# EAGLE schematic IambicKey (EAGLE 6.5.0)
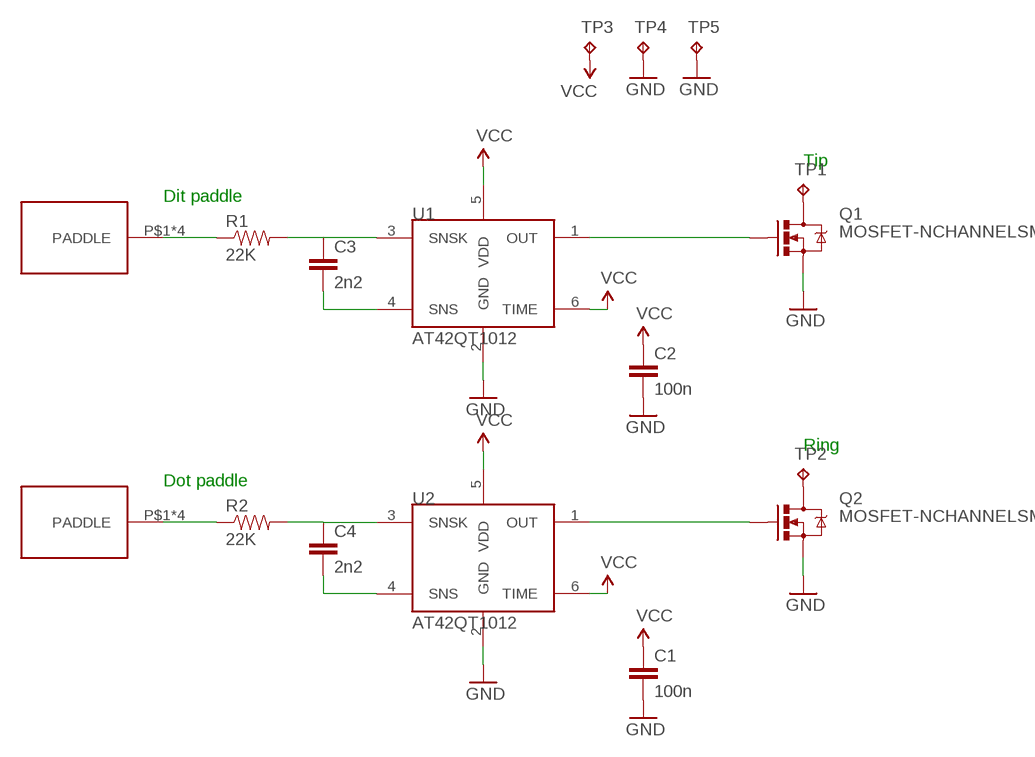
[diagram p0: schematic, sheet 1]

## Parts
C1  100n  CAP0603-CAP  [0603-CAP]
C2  100n  CAP0603-CAP  [0603-CAP]
C3  2n2  CAP0603-CAP  [0603-CAP]
C4  2n2  CAP0603-CAP  [0603-CAP]
Q1  MOSFET-NCHANNELSMD  [SOT23-3]
Q2  MOSFET-NCHANNELSMD  [SOT23-3]
R1  22K  RESISTOR0603-RES  [0603-RES]
R2  22K  RESISTOR0603-RES  [0603-RES]
TP1  TPTP20SQ  [TP20SQ]
TP2  TPTP20SQ  [TP20SQ]
TP3  TPTP20SQ  [TP20SQ]
TP4  TPTP20SQ  [TP20SQ]
TP5  TPTP20SQ  [TP20SQ]
U1  AT42QT1012  [SOT-23-6]
U2  AT42QT1012  [SOT-23-6]
U$1  PADDLE  [PADDLE]
U$2  PADDLE  [PADDLE]

## Nets
GND: C1.2 C2.2 Q1.2(S) Q2.2(S) TP4.TP TP5.TP U1.2(GND) U2.2(GND)
N$1: Q1.1(G) U1.1(OUT)
N$2: Q2.1(G) U2.1(OUT)
N$3: C3.2 U1.4(SNS)
N$4: C3.1 R1.2 U1.3(SNSK)
N$5: R1.1 U$1.P$1(PADDLE) U$1.P$2(PADDLE) U$1.P$3(PADDLE) U$1.P$4(PADDLE)
N$6: C4.2 U2.4(SNS)
N$7: C4.1 R2.2 U2.3(SNSK)
N$8: R2.1 U$2.P$1(PADDLE) U$2.P$2(PADDLE) U$2.P$3(PADDLE) U$2.P$4(PADDLE)
N$10: Q1.3(D) TP1.TP
N$11: Q2.3(D) TP2.TP
VCC: C1.1 C2.1 TP3.TP U1.5(VDD) U1.6(TIME) U2.5(VDD) U2.6(TIME)

## Notes on the sheet
- Tip
- Dit paddle
- Ring
- Dot paddle

## Library data of the parts
C1-C4 = SparkFun:CAP: Capacitor Standard 0603 ceramic capacitor, and 0.1" leaded capacitor.
Q1 Q2 = SparkFun:MOSFET-NCHANNEL
R1 R2 = SparkFun:RESISTOR: Resistor Basic schematic elements and footprints for 0603, 1206, and PTH resistors.
TP1-TP5 = testpad:TP: Test pad
U1 U2 = SparkFun:AT42QT1012: One channel touch sensor IC
U$1 U$2 = morseSounder:PADDLE